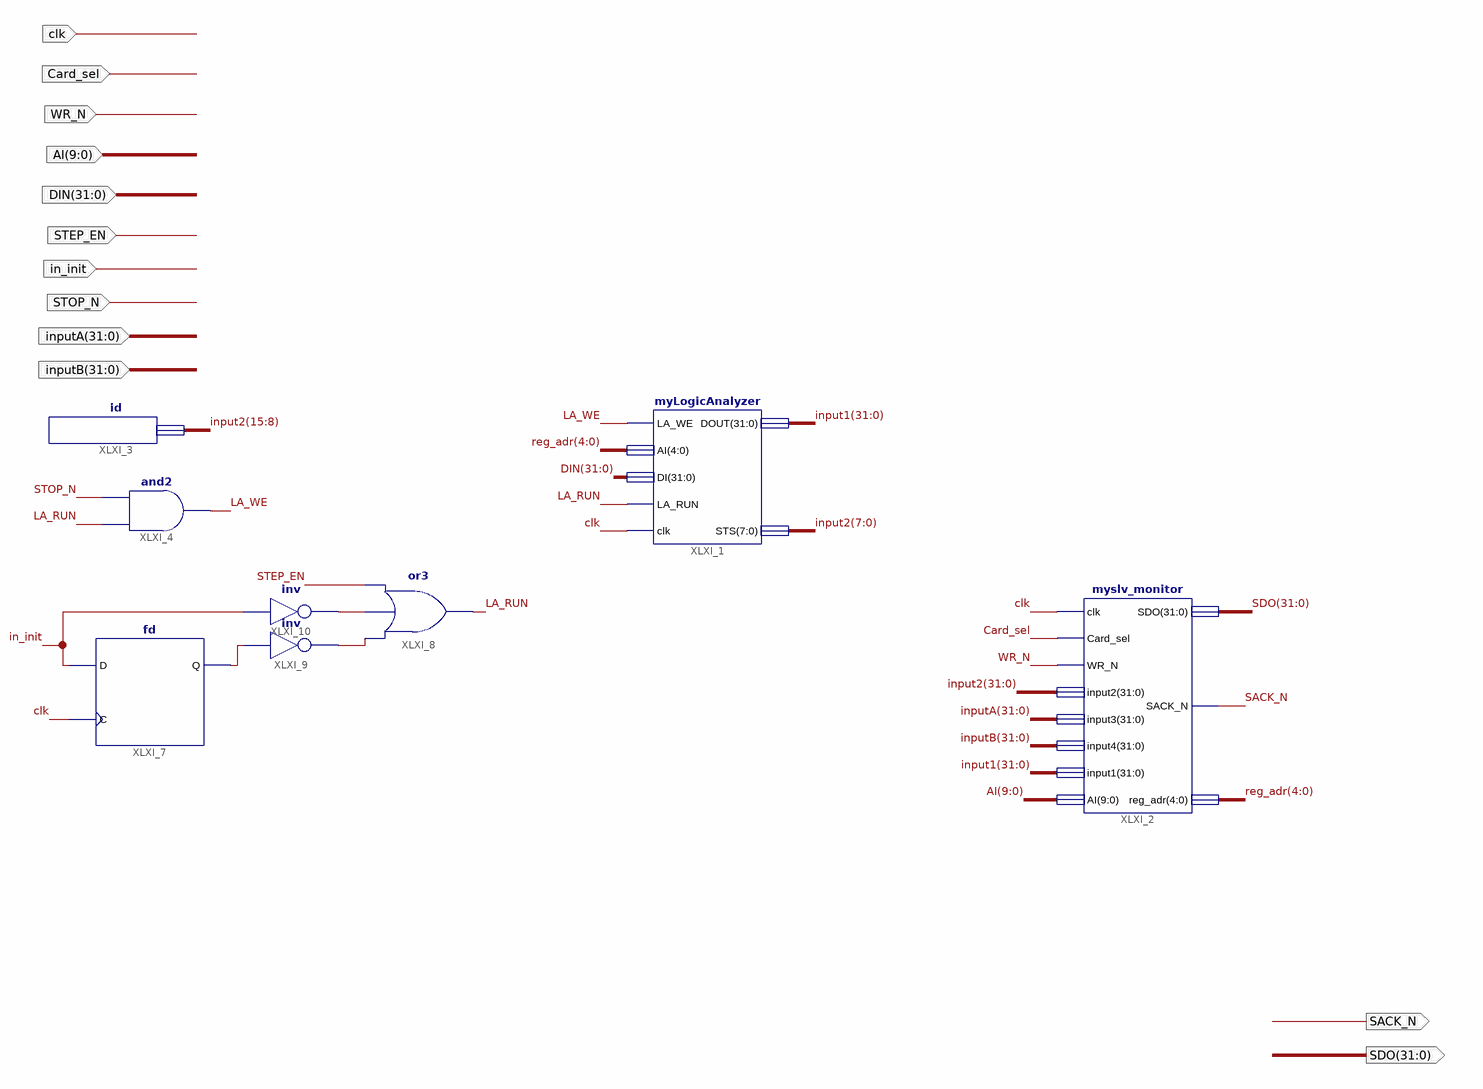
[diagram p0: schematic sheet 1]
// Xilinx ISE schematic monitorslv4C.sch (spartan2) as structural Verilog: 8 symbols, 12 ports
module monitorslv4C (
  input  clk,
  input  Card_sel,
  input  WR_N,
  input  [9:0] AI,
  input  [31:0] DIN,
  input  STEP_EN,
  input  in_init,
  input  STOP_N,
  input  [31:0] inputA,
  input  [31:0] inputB,
  output SACK_N,
  output [31:0] SDO
);

  wire LA_RUN, LA_WE, XLXN_22, XLXN_23, XLXN_24;
  wire [4:0] reg_adr;
  wire [31:0] input1, input2;

  id XLXI_3 (.id_num(input2[15:8]));
  and XLXI_4 (LA_WE, LA_RUN, STOP_N);
  not XLXI_9 (XLXN_23, XLXN_22);
  or XLXI_8 (LA_RUN, XLXN_23, XLXN_24, STEP_EN);
  fd XLXI_7 (.C(clk), .D(in_init), .Q(XLXN_22));
  not XLXI_10 (XLXN_24, in_init);
  myslv_monitor XLXI_2 (
    .clk(clk), .Card_sel(Card_sel), .WR_N(WR_N), .input2(input2), .input3(inputA), .input4(inputB),
    .input1(input1), .AI(AI), .SDO(SDO), .SACK_N(SACK_N), .reg_adr(reg_adr));
  myLogicAnalyzer XLXI_1 (
    .LA_WE(LA_WE), .AI(reg_adr), .DI(DIN), .LA_RUN(LA_RUN), .clk(clk), .DOUT(input1), .STS(input2[7:0]));
endmodule
